# EAGLE schematic three_digit_CC_PNP (EAGLE 6.5.0)
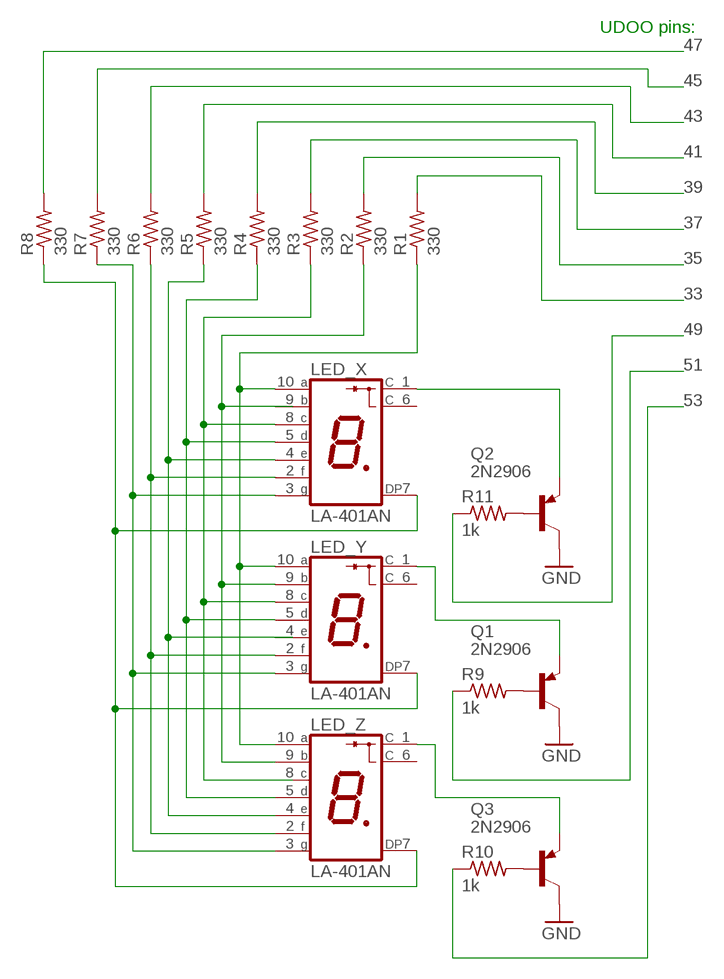
[diagram p0: schematic, sheet 1]

## Parts
LED_X  LA-401AN  [LA-401]
LED_Y  LA-401AN  [LA-401]
LED_Z  LA-401AN  [LA-401]
Q1  2N2906  [TO18]
Q2  2N2906  [TO18]
Q3  2N2906  [TO18]
R1  330  R-US_0204/7  [0204/7]
R2  330  R-US_0204/7  [0204/7]
R3  330  R-US_0204/7  [0204/7]
R4  330  R-US_0204/7  [0204/7]
R5  330  R-US_0204/7  [0204/7]
R6  330  R-US_0204/7  [0204/7]
R7  330  R-US_0204/7  [0204/7]
R8  330  R-US_0204/7  [0204/7]
R9  1k  R-US_0204/7  [0204/7]
R10  1k  R-US_0204/7  [0204/7]
R11  1k  R-US_0204/7  [0204/7]

## Nets
33: R1.2
35: R2.2
37: R3.2
39: R4.2
41: R5.2
43: R6.2
45: R7.2
47: R8.2
49: R11.1
51: R9.1
53: R10.1
GND: Q1.3(C) Q2.3(C) Q3.3(C)
JJJJJ: LED_Y.9(B) LED_Z.9(B) R2.1
N$9: LED_X.10(A) LED_Y.10(A) LED_Z.10(A) R1.1
N$11: LED_X.8(C) LED_Y.8(C) R3.1
N$12: LED_X.5(D) LED_Y.5(D) LED_Z.5(D) R4.1
N$13: LED_X.4(E) LED_Z.4(E) R5.1
N$14: LED_X.2(F) LED_Y.2(F) LED_Z.2(F) R6.1
N$15: LED_X.3(G) LED_Y.3(G) LED_Z.3(G) R7.1
N$16: LED_X.7(DP) LED_Y.7(DP) LED_Z.7(DP) R8.1
N$17: Q2.2(B) R11.2
N$18: Q3.2(B) R10.2
N$19: LED_X.1(C) Q2.1(E)
N$20: LED_Y.1(C) Q1.1(E)
N$21: LED_Z.1(C) Q3.1(E)
N$24: Q1.2(B) R9.2
Unconnected: LED_X.6(C) LED_X.9(B) LED_Y.4(E) LED_Y.6(C) LED_Z.6(C) LED_Z.8(C)

## Notes on the sheet
- UDOO pins:

## Library data of the parts
LED_X LED_Y LED_Z = led-7-segment:LA-401*N: Single Digit LED Numeric Display (cathode common) Source: ROHM .. la-1401dn.pdf; OC_FARNELL: unknown; OC_NEWARK: unknown
Q1-Q3 = transistor-pnp:2N2906*: PNP Transistor
R1-R11 = rcl:R-US_: RESISTOR, American symbol